# Altium schematic sheet MAX96717_COUPON_V2.SchDoc
size B; SheetNumber: 1; SheetTotal: 3
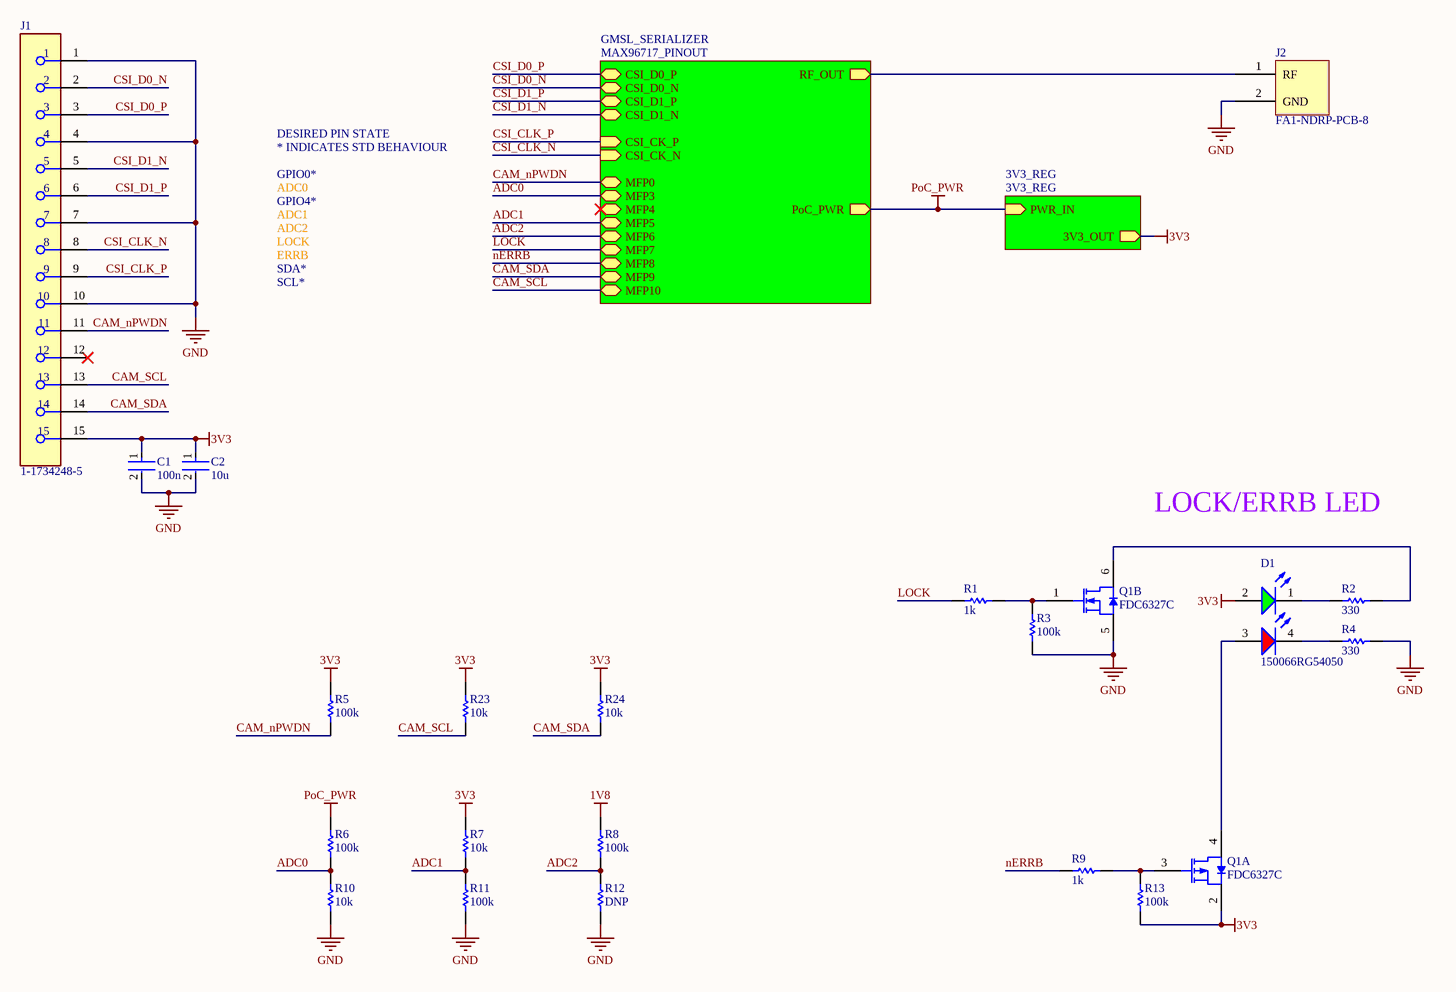
[diagram p0: MAX96717_COUPON_V2.SchDoc]

## Parts
C1  100n  [FP-0402-L_1_0_0_05-W_0_5-IPC_A]
C2  10u  [FP-0402-L_1_0_0_05-W_0_5-IPC_A]
D1  150066RG54050  [WL-SBCD_0606]
J1  1-1734248-5  [FP-1-1734248-5-MFG]
J2  FA1-NDRP-PCB-8  [FA1-NDRP-PCB-8-Footprint-1]
Q1  FDC6327C  [FAIR-SOT23-6_V]  (parts A,B of 2)
R1  1k  [R0603B]
R2  330  [R0603B]
R3  100k  [R0603B]
R4  330  [R0603B]
R5  100k  [R0603B]
R6  100k  [R0603B]
R7  10k  [R0603B]
R8  100k  [R0603B]
R9  1k  [R0603B]
R10  10k  [R0603B]
R11  100k  [R0603B]
R12  DNP  [R0603B]
R13  100k  [R0603B]
R23  10k  [R0603B]
R24  10k  [R0603B]

## Sub-sheets
3V3_REG = 3V3_REG: PWR_IN (in), 3V3_OUT (out)
GMSL_SERIALIZER = MAX96717_PINOUT: CSI_D0_P (bidir), CSI_D0_N (bidir), CSI_D1_P (bidir), CSI_D1_N (bidir), CSI_CK_P (in), CSI_CK_N (in), RF_OUT (out), PoC_PWR (out), MFP0 (bidir), MFP3 (bidir), MFP4 (bidir), MFP5 (bidir), MFP6 (bidir), MFP7 (bidir), MFP8 (bidir), MFP9 (bidir), MFP10 (bidir)

## Nets
1V8: R8.2
3V3: C1.1 C2.1 D1.2(A) J1.15 Q1.2(S) R5.2 R7.2 R13.1 R23.2 R24.2 ; sheet 3V3_REG/3V3_OUT
GND: C1.2 C2.2 J1.1 J1.4 J1.7 J1.10 J2.2(GND) Q1.5(S) R3.2 R4.1 R10.1 R11.1 R12.1
PoC_PWR: R6.2 ; sheet GMSL_SERIALIZER/PoC_PWR, sheet 3V3_REG/PWR_IN
ADC0: R6.1 R10.2 ; sheet GMSL_SERIALIZER/MFP3
ADC1: R7.1 R11.2 ; sheet GMSL_SERIALIZER/MFP5
ADC2: R8.1 R12.2 ; sheet GMSL_SERIALIZER/MFP6
CAM_nPWDN: J1.11 R5.1 ; sheet GMSL_SERIALIZER/MFP0
CAM_SCL: J1.13 R23.1 ; sheet GMSL_SERIALIZER/MFP10
CAM_SDA: J1.14 R24.1 ; sheet GMSL_SERIALIZER/MFP9
CSI_CLK_N: J1.8 ; sheet GMSL_SERIALIZER/CSI_CK_N
CSI_CLK_P: J1.9 ; sheet GMSL_SERIALIZER/CSI_CK_P
CSI_D0_N: J1.2 ; sheet GMSL_SERIALIZER/CSI_D0_N
CSI_D0_P: J1.3 ; sheet GMSL_SERIALIZER/CSI_D0_P
CSI_D1_N: J1.5 ; sheet GMSL_SERIALIZER/CSI_D1_N
CSI_D1_P: J1.6 ; sheet GMSL_SERIALIZER/CSI_D1_P
LOCK: R1.2 ; sheet GMSL_SERIALIZER/MFP7
nERRB: R9.1 ; sheet GMSL_SERIALIZER/MFP8
NetD1_1: D1.1(K) R2.2
NetD1_3: D1.3(A) Q1.4(D)
NetD1_4: D1.4(K) R4.2
NetJ2_1: J2.1(RF) ; sheet GMSL_SERIALIZER/RF_OUT
NetQ1_1: Q1.1(G) R1.1 R3.1
NetQ1_3: Q1.3(G) R9.2 R13.2
NetQ1_6: Q1.6(D) R2.1

Not connected (* = marked no-connect by the designer): J1 12*

## Notes on the sheet
- DESIRED PIN STATE
- * INDICATES STD BEHAVIOUR
- GPIO0*
- ADC0
- GPIO4*
- ADC1
- ADC2
- LOCK
- ERRB
- SDA*
- SCL*
- LOCK/ERRB LED

## Library data of the parts
C1 C2 = CMP-001-00058-1: LARGE PADS, 0402 CAP, CHANGE COMMENT TO MATCH REAL P/N; Capacitor Type: Ceramic; Min Operating Temperature: -55°C; Mounting Technology: Surface Mount; Pins: 2; Case/Package: 0402; RoHS Compliant: Yes; Max Operating Temperature: 85°C
D1 = CMP-004-00040-2: Led, Red/Grn, 180Mcd/230Mcd, 624Nm/525Nm Rohs Compliant: Yes; Source: rgled.SchLib; Component Type: Standard; Design Item ID: CMP-004-00034-2; Pins: 4
J1 = CMP-03368-000001-1: CONN FPC VERT 15POS 1.00MM SMD; Manufacturer: TE; Conn Orientation: Vertical; Conn Gender: Female; Current Rating: 1A; Is Female: yes; Number Of Contacts: 15; Pitch: 1mm; Voltage Rating: 125V; ComponentLink2URL: https://www.te.com/commerce/DocumentDelivery/DDEController?Action=showdoc&DocId=Customer+Drawing%7F1734248%7FE1%7Fpdf%7FEnglish%7FENG_CD_1734248_E1__.pdf%7F1-1734248-5; Device Class L1: Connectors; Category: Conn; Package: 0; Lead Free: Yes; Digikey Description: CONN FPC VERT 15POS 1.00MM SMD; Height: 8mm; Manufacturer Part Number: 1-1734248-5; Temperature: -20°C to +85°C; Contact Material: Gold,Nickel; Device Class L3: unset; ComponentLink2Description: Datasheet; RoHS: TRUE; Temperature Range Low: -20°C; Octopart: https://octopart.com/1-1734248-5-te+connectivity-40620898; Device Class L2: FFC / FPC; Mouser Description: FFC & FPC Connectors 15P 1.0 FPC, Zip V/T SMT; Automotive: No; Temperature Range High: +85°C; Mounting Type: Surface Mount
J2 = CMP-002-00054-1: RF F Connector, Male, Board Mount, Solder Terminal, Plug; Connector Type: RF F CONNECTOR; RoHS Compliant: Yes; Mounting Technology: Board
Q1 = CMP-2000-04939-1: Dual N & P-Channel 2.5 V Specified PowerTrench(TM) MOSFET, -55 to 150 degC, 6-Pin SOT-23, RoHS, Tape and Reel; Manufacturer: Fairchild; Typical Rise Time: 9@NChannel; Rad Hard: No; Maximum Drain Source Voltage: 20V; Typical Fall Time: 3@NChannel; Typical Turn-On Delay Time: 5@NChannel; Maximum Continuous Drain Current: 2.7@NChannel; Typical Turn-Off Delay Time: 12@NChannel; RDS-on: 80@4.5V@NChannel; Channel Mode: Enhancement; Maximum Gate Source Voltage: ±8V; Package Version: Rev. 5, 05/2015; Operating Temperature: -55to150degC; Packaging: Tape&Reel; Package Reference: SOT23-6; Package URL: https://www.fairchildsemi.com/package-drawings/MA/MA06A.pdf; Package Description: 6-Pin Small Outline Transistor, Body 2.9 x 1.6 mm, Pitch 0.95 mm; Manufacturer URL: https://www.fairchildsemi.com/; Channel Type: N; Datasheet Version: Rev. E, 07/2000; Package: 6SuperSOT; Datasheet URL: https://www.fairchildsemi.com/datasheets/FD/FDC6327C.pdf; Mounting: SurfaceMount; Category: MOSFET
R1-R6 R8 R9 R11 R13 = CMP-009-00002-14: Resistor
  R5 R6 R8 R11: Value: 100k
R7 R10 R12 R23 R24 = CMP-009-00002-14: Resistor; Value: 100k